# EAGLE design main (EAGLE 7.4.0)
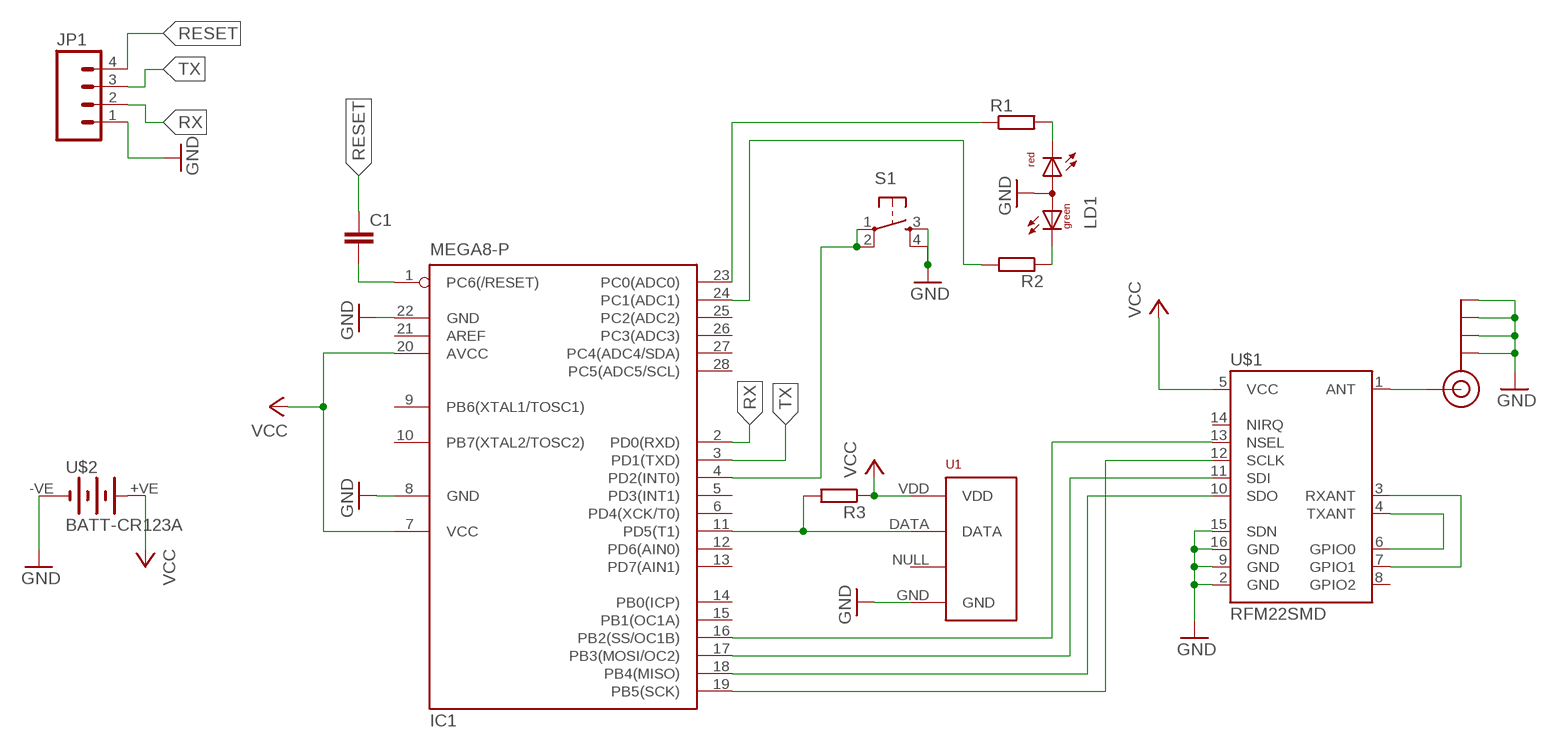
[diagram p0: schematic, sheet 1]

## Parts
C1  C-EU050-025X075  [C050-025X075]
IC1  MEGA8-P  [DIL28-3]
J$2  SMA_EDGE  [SMA-EDGE]
JP1  M04PTH  [1X04]
LD1  DUOLED-RG-A  [DUOLED-A-5MM]
R1  R-EU_0204/5  [0204/5]
R2  R-EU_0204/5  [0204/5]
R3  R-EU_0204/5  [0204/5]
S1  TAC_SWITCHPTH  [TACTILE-PTH]
U1  RHT03_DHT-22_AM2302RA  [RHT03_DHT-22/RA]
U$1  RFM22SMD  [RFM22-XXX-S2]
U$2  BATT-CR123A  [KEYSTONE-2/3A]

## Nets
GND: IC1.8(GND) IC1.22(GND) J$2.GND@0(GND) J$2.GND@1(GND) J$2.GND@2(GND) J$2.GND@3(GND) JP1.1 LD1.A S1.3 S1.4 U1.GND U$1.2(GND) U$1.9(GND) U$1.15(SDN) U$1.16(GND) U$2.-VE(-)
N$1: IC1.16(PB2(SS/OC1B)) U$1.13(NSEL)
N$2: IC1.17(PB3(MOSI/OC2)) U$1.11(SDI)
N$3: IC1.18(PB4(MISO)) U$1.10(SDO)
N$4: IC1.19(PB5(SCK)) U$1.12(SCLK)
N$5: U$1.4(TXANT) U$1.6(GPIO0)
N$6: U$1.3(RXANT) U$1.7(GPIO1)
N$7: J$2.SIG(SIGNAL) U$1.1(ANT)
N$8: LD1.CR R1.2
N$9: LD1.CX(CG) R2.1
N$10: IC1.23(PC0(ADC0)) R1.1
N$11: IC1.24(PC1(ADC1)) R2.2
N$13: IC1.11(PD5(T1)) R3.2 U1.DATA
N$14: C1.2 IC1.1(PC6(/RESET))
N$17: IC1.4(PD2(INT0)) S1.1 S1.2
RESET: C1.1 JP1.4
RX: IC1.2(PD0(RXD)) JP1.2
TX: IC1.3(PD1(TXD)) JP1.3
VCC: IC1.7(VCC) IC1.20(AVCC) R3.1 U1.VDD U$1.5(VCC) U$2.+VE(+)
Unconnected: IC1.5(PD3(INT1)) IC1.6(PD4(XCK/T0)) IC1.9(PB6(XTAL1/TOSC1)) IC1.10(PB7(XTAL2/TOSC2)) IC1.12(PD6(AIN0)) IC1.13(PD7(AIN1)) IC1.14(PB0(ICP)) IC1.15(PB1(OC1A)) IC1.21(AREF) IC1.25(PC2(ADC2)) IC1.26(PC3(ADC3)) IC1.27(PC4(ADC4/SDA)) IC1.28(PC5(ADC5/SCL)) U1.NULL U$1.8(GPIO2) U$1.14(NIRQ)

## Library data of the parts
C1 = resistor:C-EU: CAPACITOR, European symbol
IC1 = atmel:MEGA8-P: MICROCONTROLLER 8 Kbytes FLASH, 1 kbytes SRAM, 512 bytes EEPROM, USART, 4-channel 10 bit ADC, 2-channel 8 bit ADC Pin compatible with Atmega48, ATMega88, ATMega168 Source: avr.lbr; OC_FARNELL: unknown; OC_NEWARK: unknown
J$2 = SparkFun-Connectors:SMA_EDGE: SMA Antenna Connector End launch SMA connector. The paste layer has been removed so that the connector can be hand soldered onto the board after reflow.
JP1 = SparkFun-Connectors:M04: Header 4 Standard 4-pin 0.1" header. Use with straight break away headers (SKU : PRT-00116), right angle break away headers (PRT-00553), swiss pins (PRT-00743), machine pins (PRT-00117), and female headers (PRT-00115). Molex polarized connector foot print use with SKU : PRT-08231 with associated crimp pins and housings. 1MM SMD Version SKU: PRT-10208
LD1 = led:DUOLED-RG-A: DUO LED 2 colors (red/green), 5 mm, round, common Anode www.ligitek.com or other producers.
R1-R3 = resistor:R-EU_: RESISTOR, European symbol
S1 = SparkFun-Retired:TAC_SWITCH: Momentary Switch Button commonly used for reset or general input. Spark Fun Electronics SKU : COM-00097 SMT- SWCH-08247
U1 = RHT03_DHT-22_AM2302:RHT03_DHT-22_AM2302: RHT03 / DHT-22 / AM2302 Packages and symbol for the RHT03 / DHT-22 relative humidity and temperature sensor. Note: The AM2302 is a wired version of the DHT-22 which typically requires less clearance and is thus provided as a separate package.; PROD_ID: SEN-10167
U$1 = SparkFun-RF:RFM22: The RFM22 is a low-power, low cost radio that is capable of operating in the 434MHz and 900MHz open bands. It's frequency is software defined and there are some very good libraries written for it.
U$2 = eagle-library-edeca.net-v5:BATT-CR123A: CR123A (2/3rd AA) battery holder Manufacturer: Keystone Mouser part: 534-1019

## Net classes
0 default: width 0.305 mm, drill 0.508 mm, clearance 0.254 mm

## Board
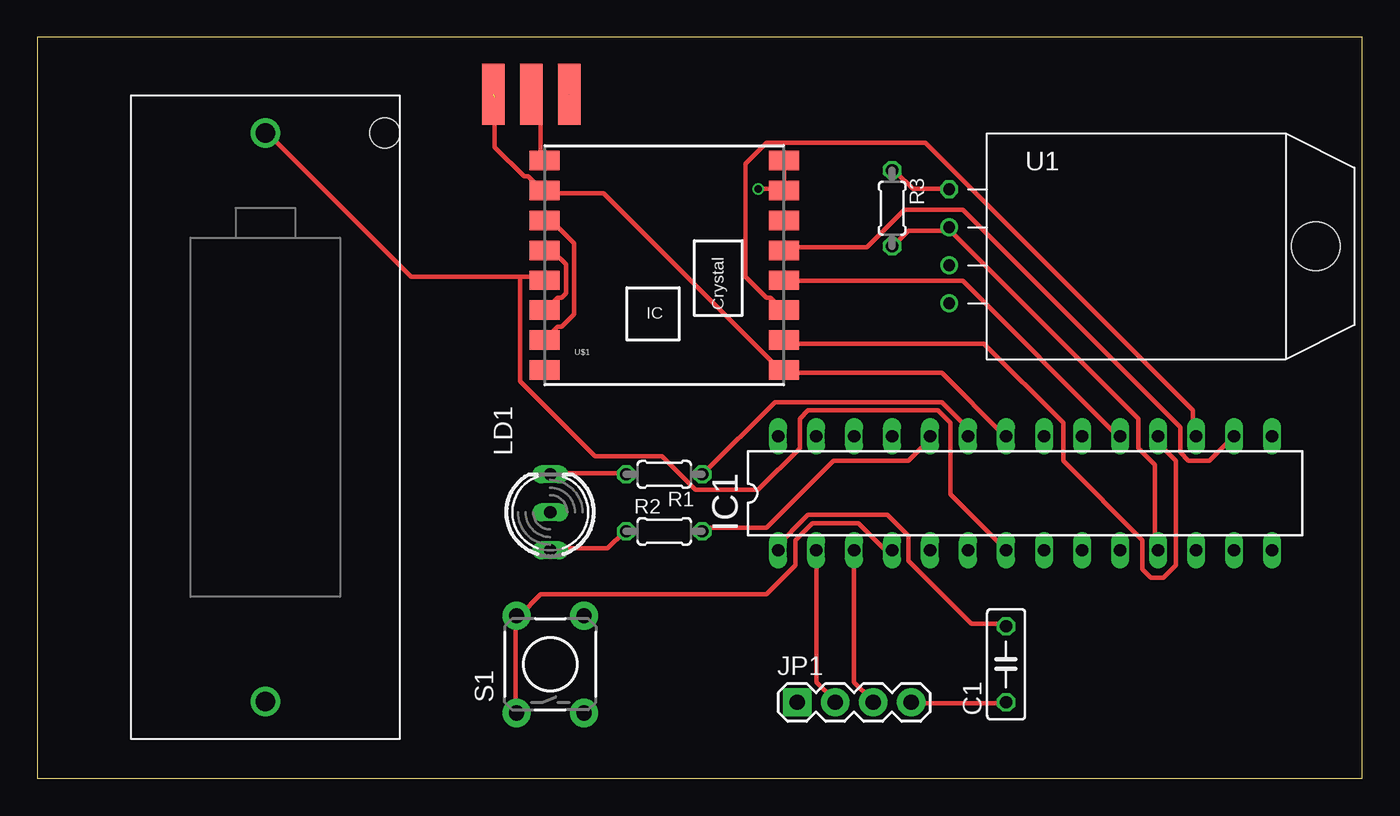
[diagram p1: board, top side]
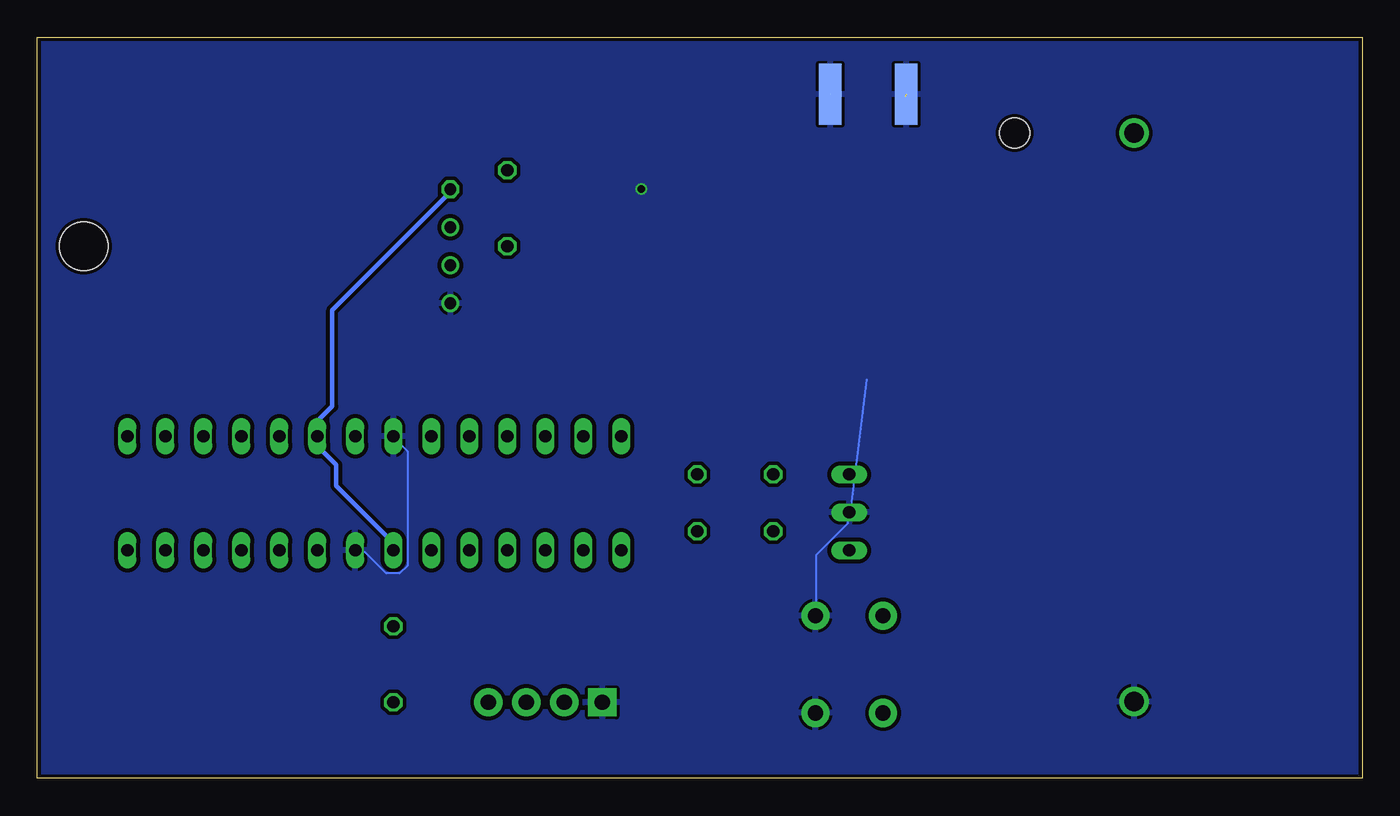
[diagram p2: board, bottom side, seen from below]

Size 88.57 x 49.52 mm. Coordinates in mm from the lower left corner, seen from the top.
Outline: 0,0 88.57,0 88.57,49.52 0,49.52 0,0
Copper layers (1*16): Top 0.018mm / dielectric 1.55mm / Bottom 0.018mm
Design rules "eC_2Layer_PClass6_BaseCopperO18_eCDefault": minimum track width 0.15mm, minimum drill 0.35mm, track to track 0.15mm, track to pad 0.15mm, pad to pad 0.15mm, via to via 0.15mm, smd to smd 0mil, copper to edge 0.25mm, drill to drill 0.35mm, minimum pad ring 0.175mm, minimum via ring 0.125mm, stop-mask expansion 0mil, vias tented up to drill 0.45mm, thermal gap 0.2mm

### Footprints (pad centres in the part's own frame; a part is rotated, then mirrored left to right if it is on the bottom)
C050-025X075 = drill 0.813 octagon: 1 -2.54,0; 2 2.54,0
DIL28-3 = drill 0.813 long: 1 -16.51,-3.81; 2 -13.97,-3.81; 3 -11.43,-3.81; 4 -8.89,-3.81; 5 -6.35,-3.81; 6 -3.81,-3.81; 7 -1.27,-3.81; 8 1.27,-3.81; 9 3.81,-3.81; 10 6.35,-3.81; 11 8.89,-3.81; 12 11.43,-3.81; 13 13.97,-3.81; 14 16.51,-3.81; 15 16.51,3.81; 16 13.97,3.81; 17 11.43,3.81; 18 8.89,3.81; 19 6.35,3.81; 20 3.81,3.81; 21 1.27,3.81; 22 -1.27,3.81; 23 -3.81,3.81; 24 -6.35,3.81; 25 -8.89,3.81; 26 -11.43,3.81; 27 -13.97,3.81; 28 -16.51,3.81
SMA-EDGE = smd 1.524 x 4.064: GND@0 0,0; GND@1 5.08,0; SIG 2.54,0 | smd 1.524 x 4.064 bottom: GND@2 0,0; GND@3 5.08,0
1X04 = drill 1.016 pad 1.88 square: 1 0,0 | drill 1.016 pad 1.88: 2 2.54,0; 3 5.08,0; 4 7.62,0
DUOLED-A-5MM = drill 0.813 long: A 0,0; CR 2.54,0; CX -2.54,0
0204/5 = drill 0.813 octagon: 1 -2.54,0; 2 2.54,0
TACTILE-PTH = drill 1.016 pad 1.88: 1 -3.251,2.261; 2 3.251,2.261; 3 -3.251,-2.261; 4 3.251,-2.261
RHT03_DHT-22/RA = drill 0.8: DATA -1.27,0; GND 3.81,0; NULL 1.27,0 | drill 0.8 octagon: VDD -3.81,0 | hole 3.25: 0,24.5
RFM22-XXX-S2 = smd 2 x 1.3: 1 -8,7; 2 -8,5; 3 -8,3; 4 -8,1; 5 -8,-1; 6 -8,-3; 7 -8,-5; 8 -8,-7; 9 8,-7; 10 8,-5; 11 8,-3; 12 8,-1; 13 8,1; 14 8,3; 15 8,5; 16 8,7
KEYSTONE-2/3A = drill 1.3: +VE 0,19; -VE 0,-19 | hole 2: 8,19

### Placement (x,y rotation side)
C1  64.77,7.62 90 top
IC1  66.04,19.05 0 top
J$2  30.48,45.72 0 top
JP1  50.8,5.08 0 top
LD1  34.29,17.78 90 top
R1  41.91,20.32 180 top
R2  41.91,16.51 0 top
R3  57.15,38.1 270 top
S1  34.29,7.62 90 top
U1  60.96,35.56 270 top
U$1  41.91,34.29 0 top
U$2  15.24,24.13 0 top

### Tracks (layer width: path | path; a pad name or v marks a point on that pad's centre or on a via)
GND  (via drill 0.51)  (3 unrouted)
  Top 0.15: U$1.15 49.97,39.43 49.97,41.2 U$1.16
  Top 0.305: 30.58,45.54 30.58,42.19 32.54,40.23 32.82,40.23 33.65,39.4 U$1.2 33.93,39.12 37.85,39.12 49.86,27.1 U$1.9 50.14,27.1 60.48,27.1 64.67,22.91 IC1.22 | v48.18,39.4 49.86,39.4 U$1.15
  Bottom 0.15: 64.72,22.74 63.83,21.86 63.83,14.22 64.36,13.69 65.25,13.69 66.67,15.11 67.2,15.11 IC1.8 | S1.4 36.49,11.03 36.49,14.93 34.36,17.06 34.36,17.77 LD1.A 34.19,17.95 33.11,26.65
  pour Bottom: -1.27,50.8 -1.27,-1.27 90.17,-1.27 90.17,50.8
N$1
  Top 0.305: U$1.13 50.14,35.48 55.45,35.48 57.96,38 61.87,38 76.4,23.47 76.4,21.79 76.96,21.23 78.36,21.23 79.76,22.63 IC1.16
N$2
  Top 0.305: U$1.11 49.86,31.29 49.02,32.13 48.74,32.13 47.35,33.53 47.35,41.07 48.74,42.47 59.36,42.47 77.24,24.59 77.24,22.91 IC1.17
N$3
  Top 0.305: U$1.10 50.14,29.06 63.27,29.06 68.58,23.75 68.58,21.23 73.89,15.93 73.89,13.97 74.45,13.41 75.29,13.41 76.12,14.25 76.12,21.23 74.73,22.63 IC1.18
N$4
  Top 0.305: U$1.12 50.14,33.25 61.87,33.25 72.21,22.91 IC1.19
N$5
  Top 0.305: U$1.6 33.93,31.29 34.77,32.13 35.05,32.13 35.33,32.41 35.33,34.37 34.49,35.2 33.93,35.2 U$1.4
N$6
  Top 0.305: U$1.7 33.93,29.34 34.77,30.18 35.05,30.18 35.89,31.01 35.89,35.76 34.49,37.16 33.93,37.16 U$1.3
N$7
  Top 0.305: U$1.1 33.65,41.35 33.65,44.98 33.1,45.54 J$2.SIG
N$8
  Top 0.305: LD1.CR 34.49,20.4 39.24,20.4 R1.2
N$9
  Top 0.305: LD1.CX 34.49,15.37 38.12,15.37 39.24,16.48 R2.1
N$10
  Top 0.305: R1.1 44.55,20.4 49.3,25.15 60.48,25.15 62.15,23.47 62.15,22.91 IC1.23
N$11
  Top 0.305: R2.2 44.55,16.76 48.74,16.76 53.21,21.23 58.24,21.23 59.64,22.63 IC1.24
N$13
  Top 0.305: R3.2 57.4,35.76 58.24,36.6 60.76,36.6 U1.DATA 61.04,36.6 73.61,24.03 73.61,22.07 74.73,20.95 74.73,15.37 IC1.11
N$14
  Top 0.305: C1.2 64.67,10.34 62.43,10.34 58.24,14.53 58.24,16.2 56.84,17.6 51.54,17.6 49.3,15.37 IC1.1
N$17
  Top 0.305: IC1.4 57.12,15.37 56.57,15.37 54.89,17.04 51.82,17.04 50.7,15.93 50.7,14.25 48.74,12.29 33.65,12.29 32.26,10.9 S1.2 31.98,10.62 31.98,4.47 S1.1
RESET
  Top 0.305: C1.1 64.67,5.03 58.52,5.03 JP1.4
RX
  Top 0.305: IC1.2 52.09,15.09 52.09,6.43 53.21,5.31 JP1.2
TX
  Top 0.305: IC1.3 54.61,6.43 55.73,5.31 JP1.3
VCC
  Top 0.305: 32.26,33.53 24.99,33.53 15.49,43.03 U$2.+VE | 32.26,33.53 33.65,33.53 U$1.5 | U1.VDD 60.76,39.4 58.52,39.4 57.4,40.51 R3.1 | 32.26,33.53 32.26,26.54 37.29,21.51 41.76,21.51 43.99,19.28 48.18,19.28 50.98,22.07 50.98,24.03 51.54,24.59 60.2,24.59 61.04,23.75 61.04,19 64.67,15.37 IC1.7
  Bottom 0.305: IC1.7 64.95,15.37 64.95,15.93 68.58,19.56 68.58,20.95 69.7,22.07 69.7,22.63 IC1.20 69.7,22.91 69.7,24.03 68.86,24.87 68.86,31.29 61.04,39.12 U1.VDD